# EAGLE design USBLiPo (EAGLE 6.5.0)
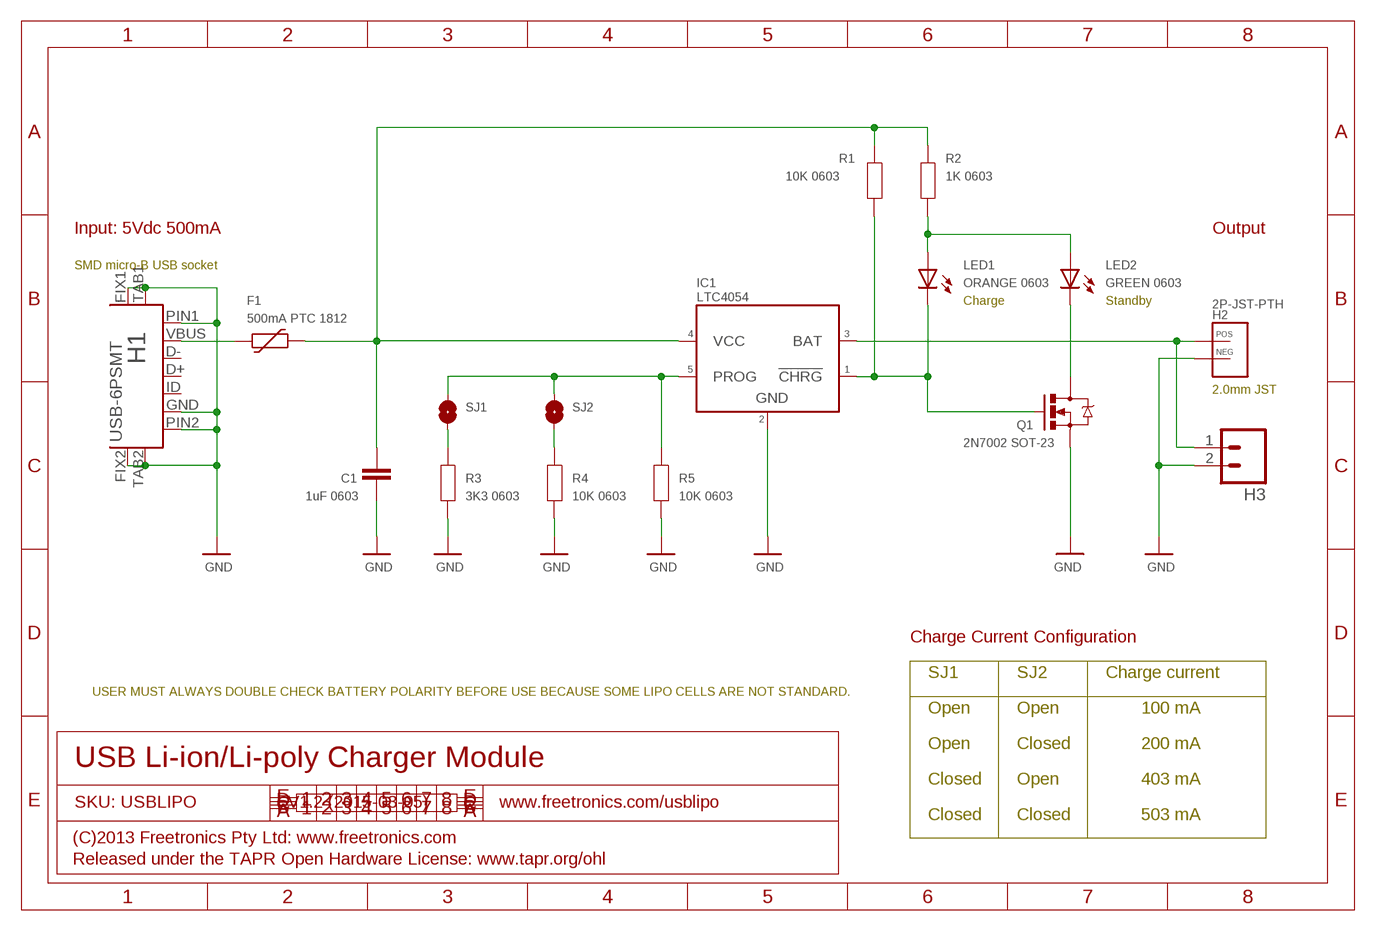
[diagram p0: schematic, sheet 1]

## Parts
C1  1uF 0603  CAP0603  [0603]
F1  500mA PTC 1812  PTC  [1812]
H1  USB-6PSMT  [USB-MICROB-MB05PMXX]
H2  2P-JST-PTH  2P-JST-TH-RAPTH  [JST-2MM-TH-RA]
H3  M02PTH  [1X02]
IC1  LTC4054  [SOT23-5]
LED1  ORANGE 0603  LED0603  [LED-0603]
LED2  GREEN 0603  LED0603  [LED-0603]
Q1  2N7002 SOT-23  2N7002  [SOT23-3]
R1  10K 0603  RESISTOR0603  [0603]
R2  1K 0603  RESISTOR0603  [0603]
R3  3K3 0603  RESISTOR0603  [0603]
R4  10K 0603  RESISTOR0603  [0603]
R5  10K 0603  RESISTOR0603  [0603]
SJ1  SJ  [SJ]
SJ2  SJ  [SJ]

## Nets
GND: C1.1 H1.FIX1 H1.FIX2 H1.GND H1.PIN1 H1.PIN2 H1.TAB1 H1.TAB2 H2.NEG H3.2 IC1.2(GND) Q1.2(S) R3.2 R4.2 R5.2
N$1: LED2.C Q1.3(D)
N$2: C1.2 F1.2 IC1.4(VCC) R1.1 R2.1
N$3: IC1.5(PROG) R5.1 SJ1.2 SJ2.2
N$4: H2.POS H3.1 IC1.3(BAT)
N$5: R3.1 SJ1.1
N$6: IC1.1(!CHRG) LED1.C Q1.1(G) R1.2
N$7: R4.1 SJ2.1
N$8: LED1.A LED2.A R2.2
N$113: F1.1 H1.VBUS
Unconnected: H1.D+ H1.D- H1.ID

## Notes on the sheet
- Input: 5Vdc 500mA | Output
- SMD micro-B USB socket
- Charge | Standby
- 2.0mm JST
- Charge Current Configuration
- SJ1 | SJ2 | Charge current
- USER MUST ALWAYS DOUBLE CHECK BATTERY POLARITY BEFORE USE BECAUSE SOME LIPO CELLS ARE NOT STANDARD.
- Open | Open | 100 mA
- Open | Closed | 200 mA
- USB Li-ion/Li-poly Charger Module
- Closed | Open | 403 mA
- SKU: USBLIPO | V1.2 (2015-03-05) | www.freetronics.com/usblipo
- Closed | Closed | 503 mA
- (C)2013 Freetronics Pty Ltd: www.freetronics.com
- Released under the TAPR Open Hardware License: www.tapr.org/ohl

## Library data of the parts
C1 = freetronics:CAP: Capacitor Standard 0603 ceramic capacitor, and 0.1" leaded capacitor.
F1 = freetronics-luke:PTC: Polymeric PTC ("Polyfuse")
H1 = freetronics-jon:USB-6P
H2 = freetronics-jon:2P-JST-TH-RA: 2.0 mm pitch, through-hole 2-pin right-angle JST header, suitable for small Li-po batteries.
H3 = freetronics-master-v1.1:M02: Header 2 Standard 2-pin 0.1" header. Use with straight break away headers (SKU : PRT-00116), right angle break away headers (PRT-00553), swiss pins (PRT-00743), machine pins (PRT-00117), and female headers (PRT-00115). Molex polarized connector foot print use with SKU : PRT-08233 with associated crimp pins and housings.
IC1 = freetronics-luke:LTC4054: Linear Technologies LTC4054 Li-ion battery charger in SOT23-5. (Or equivalent device.) http://cds.linear.com/docs/Datasheet/405442xf.pdf
LED1 LED2 = freetronics-master-v1:LED: LEDs Standard schematic elements and footprints for 5mm, 3mm, 1206, and 0603 sized LEDs. 5mm - Spark Fun Electronics SKU : COM-00529 (and others)
Q1 = freetronics-luke:2N7002: 2N7002 N-ch MOSFET in SOT-23.
R1-R5 = freetronics:RESISTOR: Resistor Basic schematic elements and footprints for 0603, 1206, and PTH 1/10th watt (small) resistors.
SJ1 SJ2 = freetronics-luke:SJ: PCB "solder jumper". Note that there should nothing on the BOM corresponding to this "component".

## Board
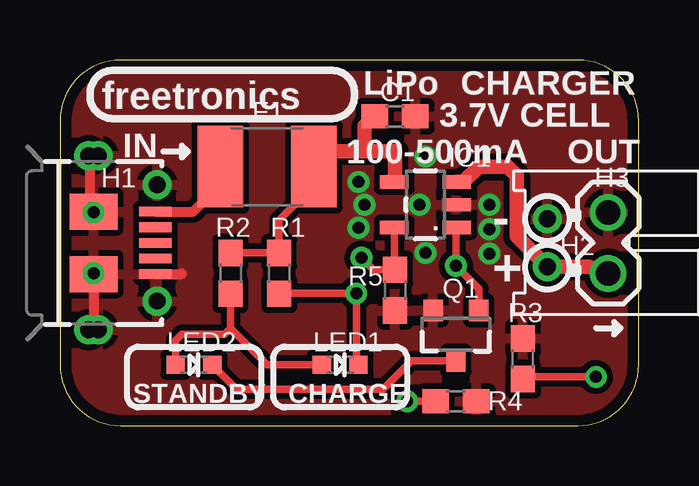
[diagram p1: board, top side]
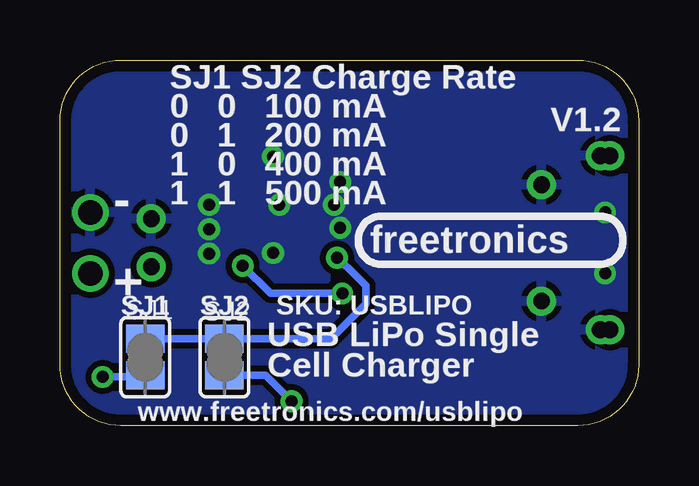
[diagram p2: board, bottom side, seen from below]

Size 24.13 x 15.24 mm. Coordinates in mm from the lower left corner, seen from the top.
Outline: 0,2.54 arc90 2.54,0 21.59,0 arc90 24.13,2.54 24.13,12.7 arc90 21.59,15.24 2.54,15.24 arc90 0,12.7 0,2.54
Copper layers (1*16): Top 0.035mm / dielectric 1.5mm / Bottom 0.035mm
Design rules "default": minimum track width 10mil, minimum drill 15mil, track to track 10mil, track to pad 10mil, pad to pad 10mil, via to via 10mil, smd to smd 8mil, copper to edge 18mil, drill to drill 8mil, minimum pad ring 10mil, minimum via ring 8mil, stop-mask expansion 4mil, vias tented up to drill 25mil, thermal gap 10mil

### Footprints (pad centres in the part's own frame; a part is rotated, then mirrored left to right if it is on the bottom)
0603 = smd 1.1 x 1: 1 -0.85,0; 2 0.85,0
1812 = smd 1.9 x 3.4: 1 -1.95,0; 2 1.95,0
USB-MICROB-MB05PMXX = smd 0.4 x 1.35: D+ 0,2.575; D- -0.65,2.575; GND 1.3,2.575; ID 0.65,2.575; VBUS -1.3,2.575 | smd 1.5 x 2: FIX1 -1.3,0; FIX2 1.3,0 | drill 0.7: PIN1 -2.425,2.65; PIN2 2.425,2.65; SLOT1 -3.625,-0.2; SLOT2 3.625,-0.2; TAB1 -3.625,0.2; TAB2 3.625,0.2
JST-2MM-TH-RA = drill 0.7: NEG -1,-3.81; POS 1,-3.81
1X02 = drill 1.016: 1 0,0; 2 2.54,0
SOT23-5 = smd 0.55 x 1.2: 1 -0.95,-1.3; 2 0,-1.3; 3 0.95,-1.3; 4 0.95,1.3; 5 -0.95,1.3
LED-0603 = smd 0.762 x 0.762: A -0.762,0; C 0.762,0
SOT23-3 = smd 0.8 x 0.9: 1 -0.95,-1; 2 0.95,-1; 3 0,1.1
SJ = smd 1.168 x 1.6: 1 -0.762,0; 2 0.762,0

### Placement (x,y rotation side)
C1  13.97,12.89 180 top
F1  8.64,10.79 0 top
H1  1.4,7.62 270 top
H2  24.13,7.62 270 top
H3  22.86,6.35 90 top
IC1  15.24,9.21 90 top
LED1  11.68,2.54 0 top
LED2  5.59,2.54 0 top
Q1  16.51,3.81 180 top
R1  9.14,6.35 270 top
R2  7.11,6.35 270 top
R3  19.3,2.79 90 top
R4  16.51,1.02 0 top
R5  13.97,5.65 270 top
SJ1  20.57,2.86 90 bottom
SJ2  17.27,2.86 90 bottom

### Tracks (layer width: path | path; a pad name or v marks a point on that pad's centre or on a via)
GND  (via drill 0.5)
  Top 0.406: H1.GND 5.08,6.32 5.08,6.35 | H1.FIX2 1.4,4.2 H1.TAB2 | H1.FIX1 1.3,8.92 1.27,8.89 1.27,10.92 H1.TAB1
  other vias: 14.99,9.21 12.7,9.21 12.45,10.16 15.24,7.2 15.24,11.21 17.91,9.21 1.4,8.89 12.45,8.26 1.4,6.35 17.91,8.19 17.91,7.18
  pour Top: 2.54,15.24 21.59,15.24 arc-90 24.13,12.7 24.13,2.54 arc-90 21.59,0 2.54,0 arc-90 0,2.54 0,12.7 arc-90
  pour Bottom: 2.54,15.24 21.59,15.24 arc-90 24.13,12.7 24.13,2.54 arc-90 21.59,0 2.54,0 arc-90 0,2.54 0,12.7 arc-90
N$1
  Top 0.305: LED2.C 7.37,1.52 13.46,1.52 14.65,2.71 Q1.3
  Top 0.406: 16.51,2.65 Q1.3
N$2
  Top 0.305: R2.1 R1.1 9.14,8.57 10.79,10.22
  Top 0.406: 10.2,11.79 10.76,11.79 11.11,11.43 10.59,10.9 F1.2 10.79,10.59 10.79,10.22
  Top 0.457: 10.2,11.79 10.16,11.75 10.54,11.75 | 13.97,10.19 IC1.4
  Top 0.61: 13.97,10.19 13.97,11.43 12.7,11.43 | 11.11,11.43 12.7,11.43 | C1.2 12.7,12.47 12.7,11.43
N$3  (via drill 0.5)
  Top 0.305: 13.94,6.53 IC1.5 | R5.1 13.07,6.5 v12.57,7
  Top 0.457: R5.1 13.94,6.53
  Bottom 0.305: v12.57,7 12.01,6.49 11.37,5.84 11.37,5.08 12.83,3.62 SJ2.2 SJ1.2
N$4
  Top 0.61: IC1.3 16.82,10.16 17.46,10.79 18.67,10.79 19.05,10.41 19.05,7.89 H2.POS 22.08,6.62 H3.1
N$5  (via drill 0.5)
  Top 0.305: R3.1 19.39,2.03 v22.35,2.03
  Bottom 0.305: v22.35,2.03 20.64,2.03 SJ1.1
N$6  (via drill 0.5)
  Top 0.305: 16.51,8.23 v16.51,6.67 17.46,5.72 Q1.1 | 12.36,2.71 v12.36,5.51 9.16,5.51 R1.2
  Top 0.406: LED1.C 12.36,2.71
  Top 0.457: 16.51,8.23 IC1.1
  Bottom 0.305: v12.36,5.51 15.36,5.51 v16.51,6.67
N$7  (via drill 0.5)
  Top 0.305: R4.1 v14.48,1.02
  Bottom 0.305: v14.48,1.02 15.56,2.1 SJ2.1
N$8
  Top 0.305: LED1.A 8.64,2.54 7.11,4.06 | 7.11,4.06 R2.2 | LED2.A 4.83,3.56 5.08,3.81 6.86,3.81 7.11,4.06
N$113
  Top 0.406: H1.VBUS 5.55,8.92 6.86,10.22
  Top 0.457: 6.89,10.81 F1.1 6.86,10.78 6.86,10.22 6.73,10.73

### Text on the board
tPlace: LiPo | CHARGER | freetronics | 3.7V CELL | IN | 100-500mA | OUT | - | + | STANDBY | CHARGE
bPlace: SJ1 SJ2 Charge Rate | 0 0 100 mA | V1.2 | 0 1 200 mA | 1 0 400 mA | 1 1 500 mA | - | freetronics | SKU: USBLIPO | SJ2 | SJ1 | + | USB LiPo Single | Cell Charger | www.freetronics.com/usblipo